# EAGLE design SubHarmonics Main Board v2 (EAGLE 9.6.2)
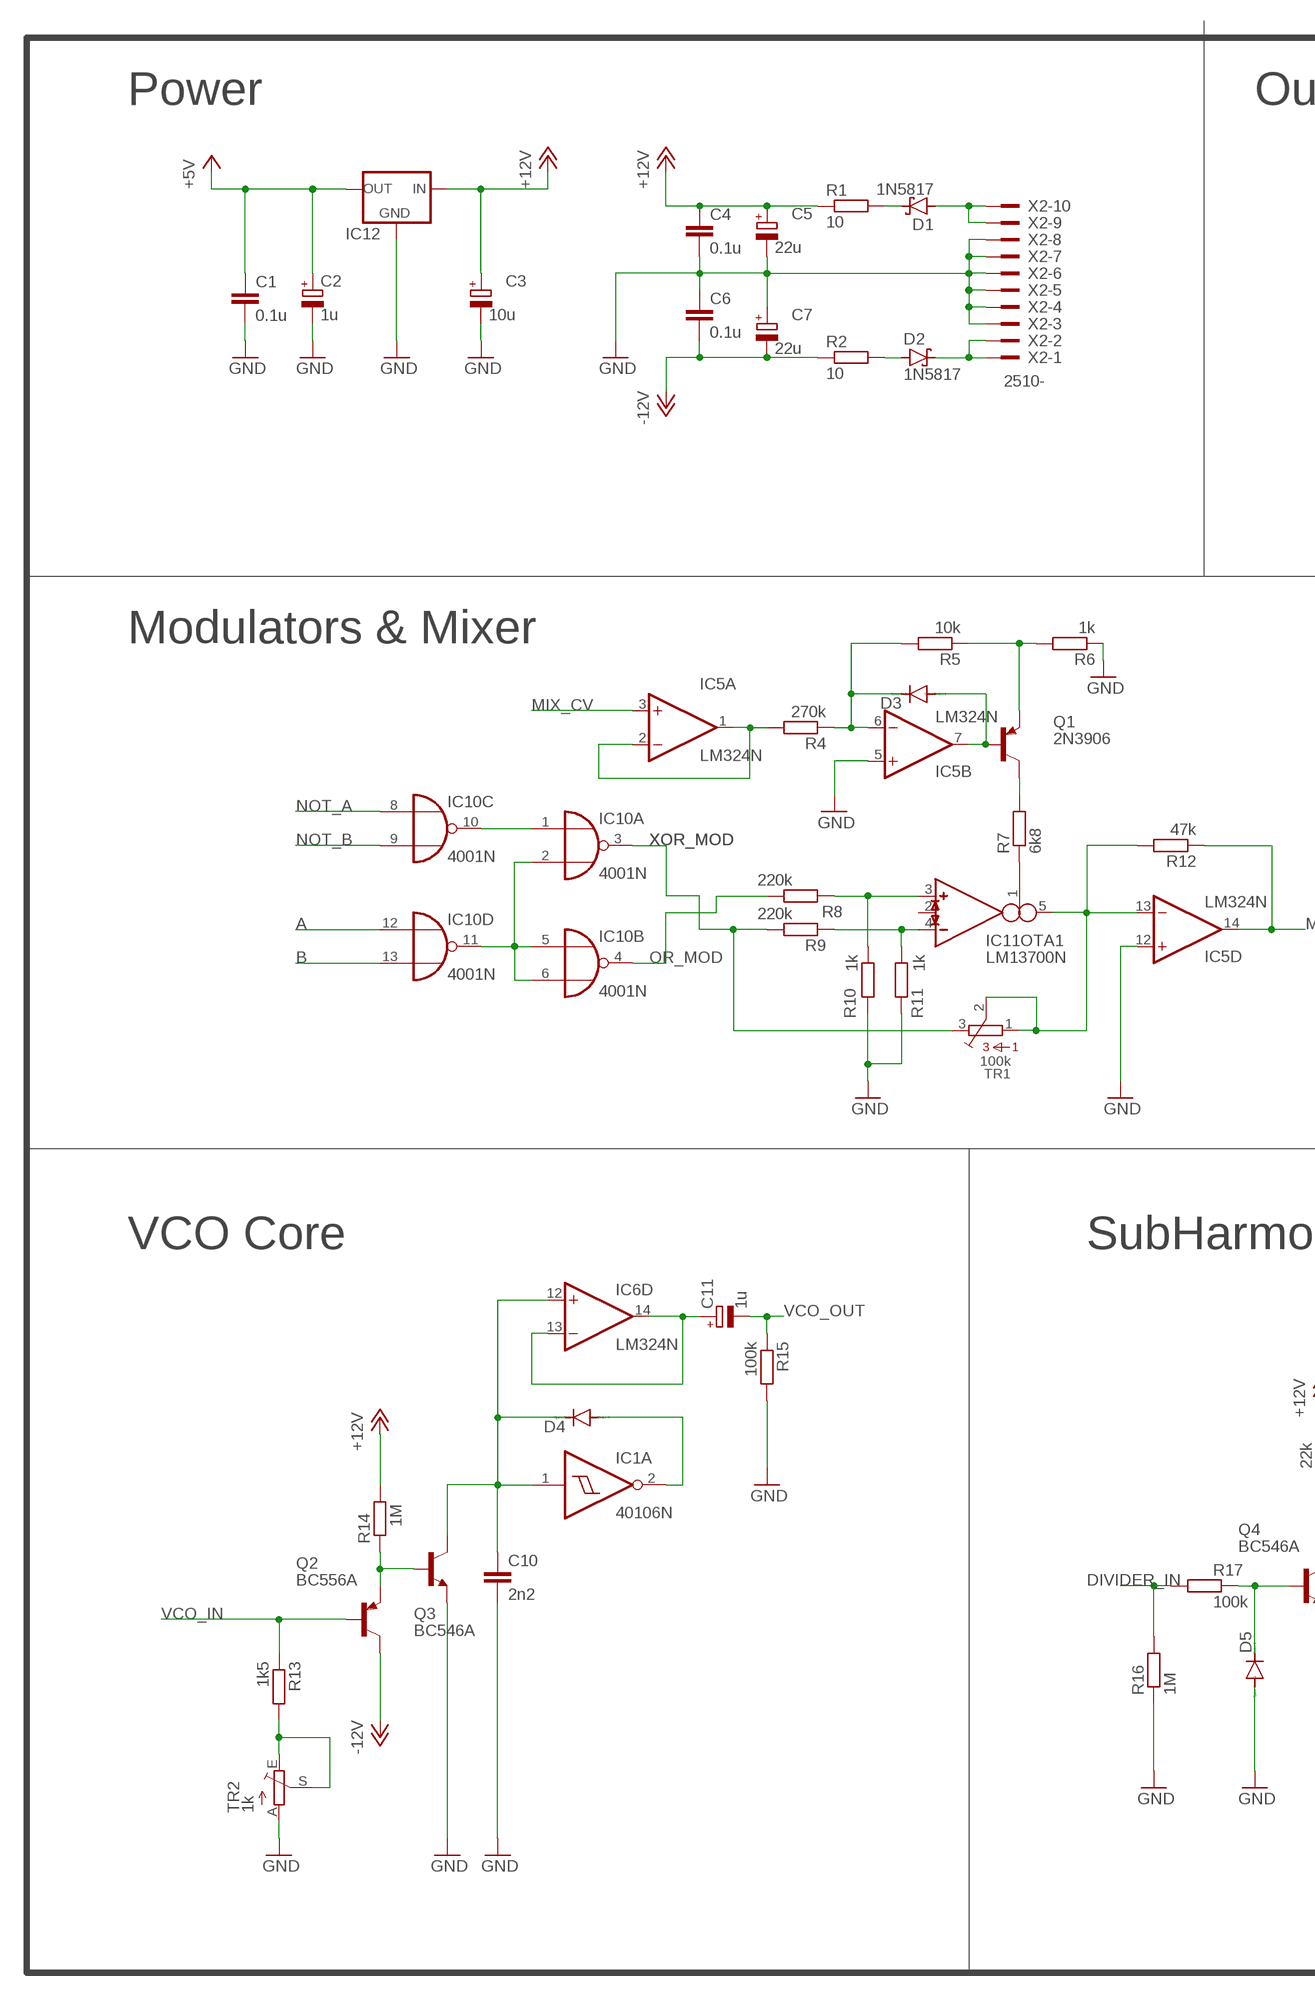
[diagram p0: schematic, sheet 1, part 1 of 2]
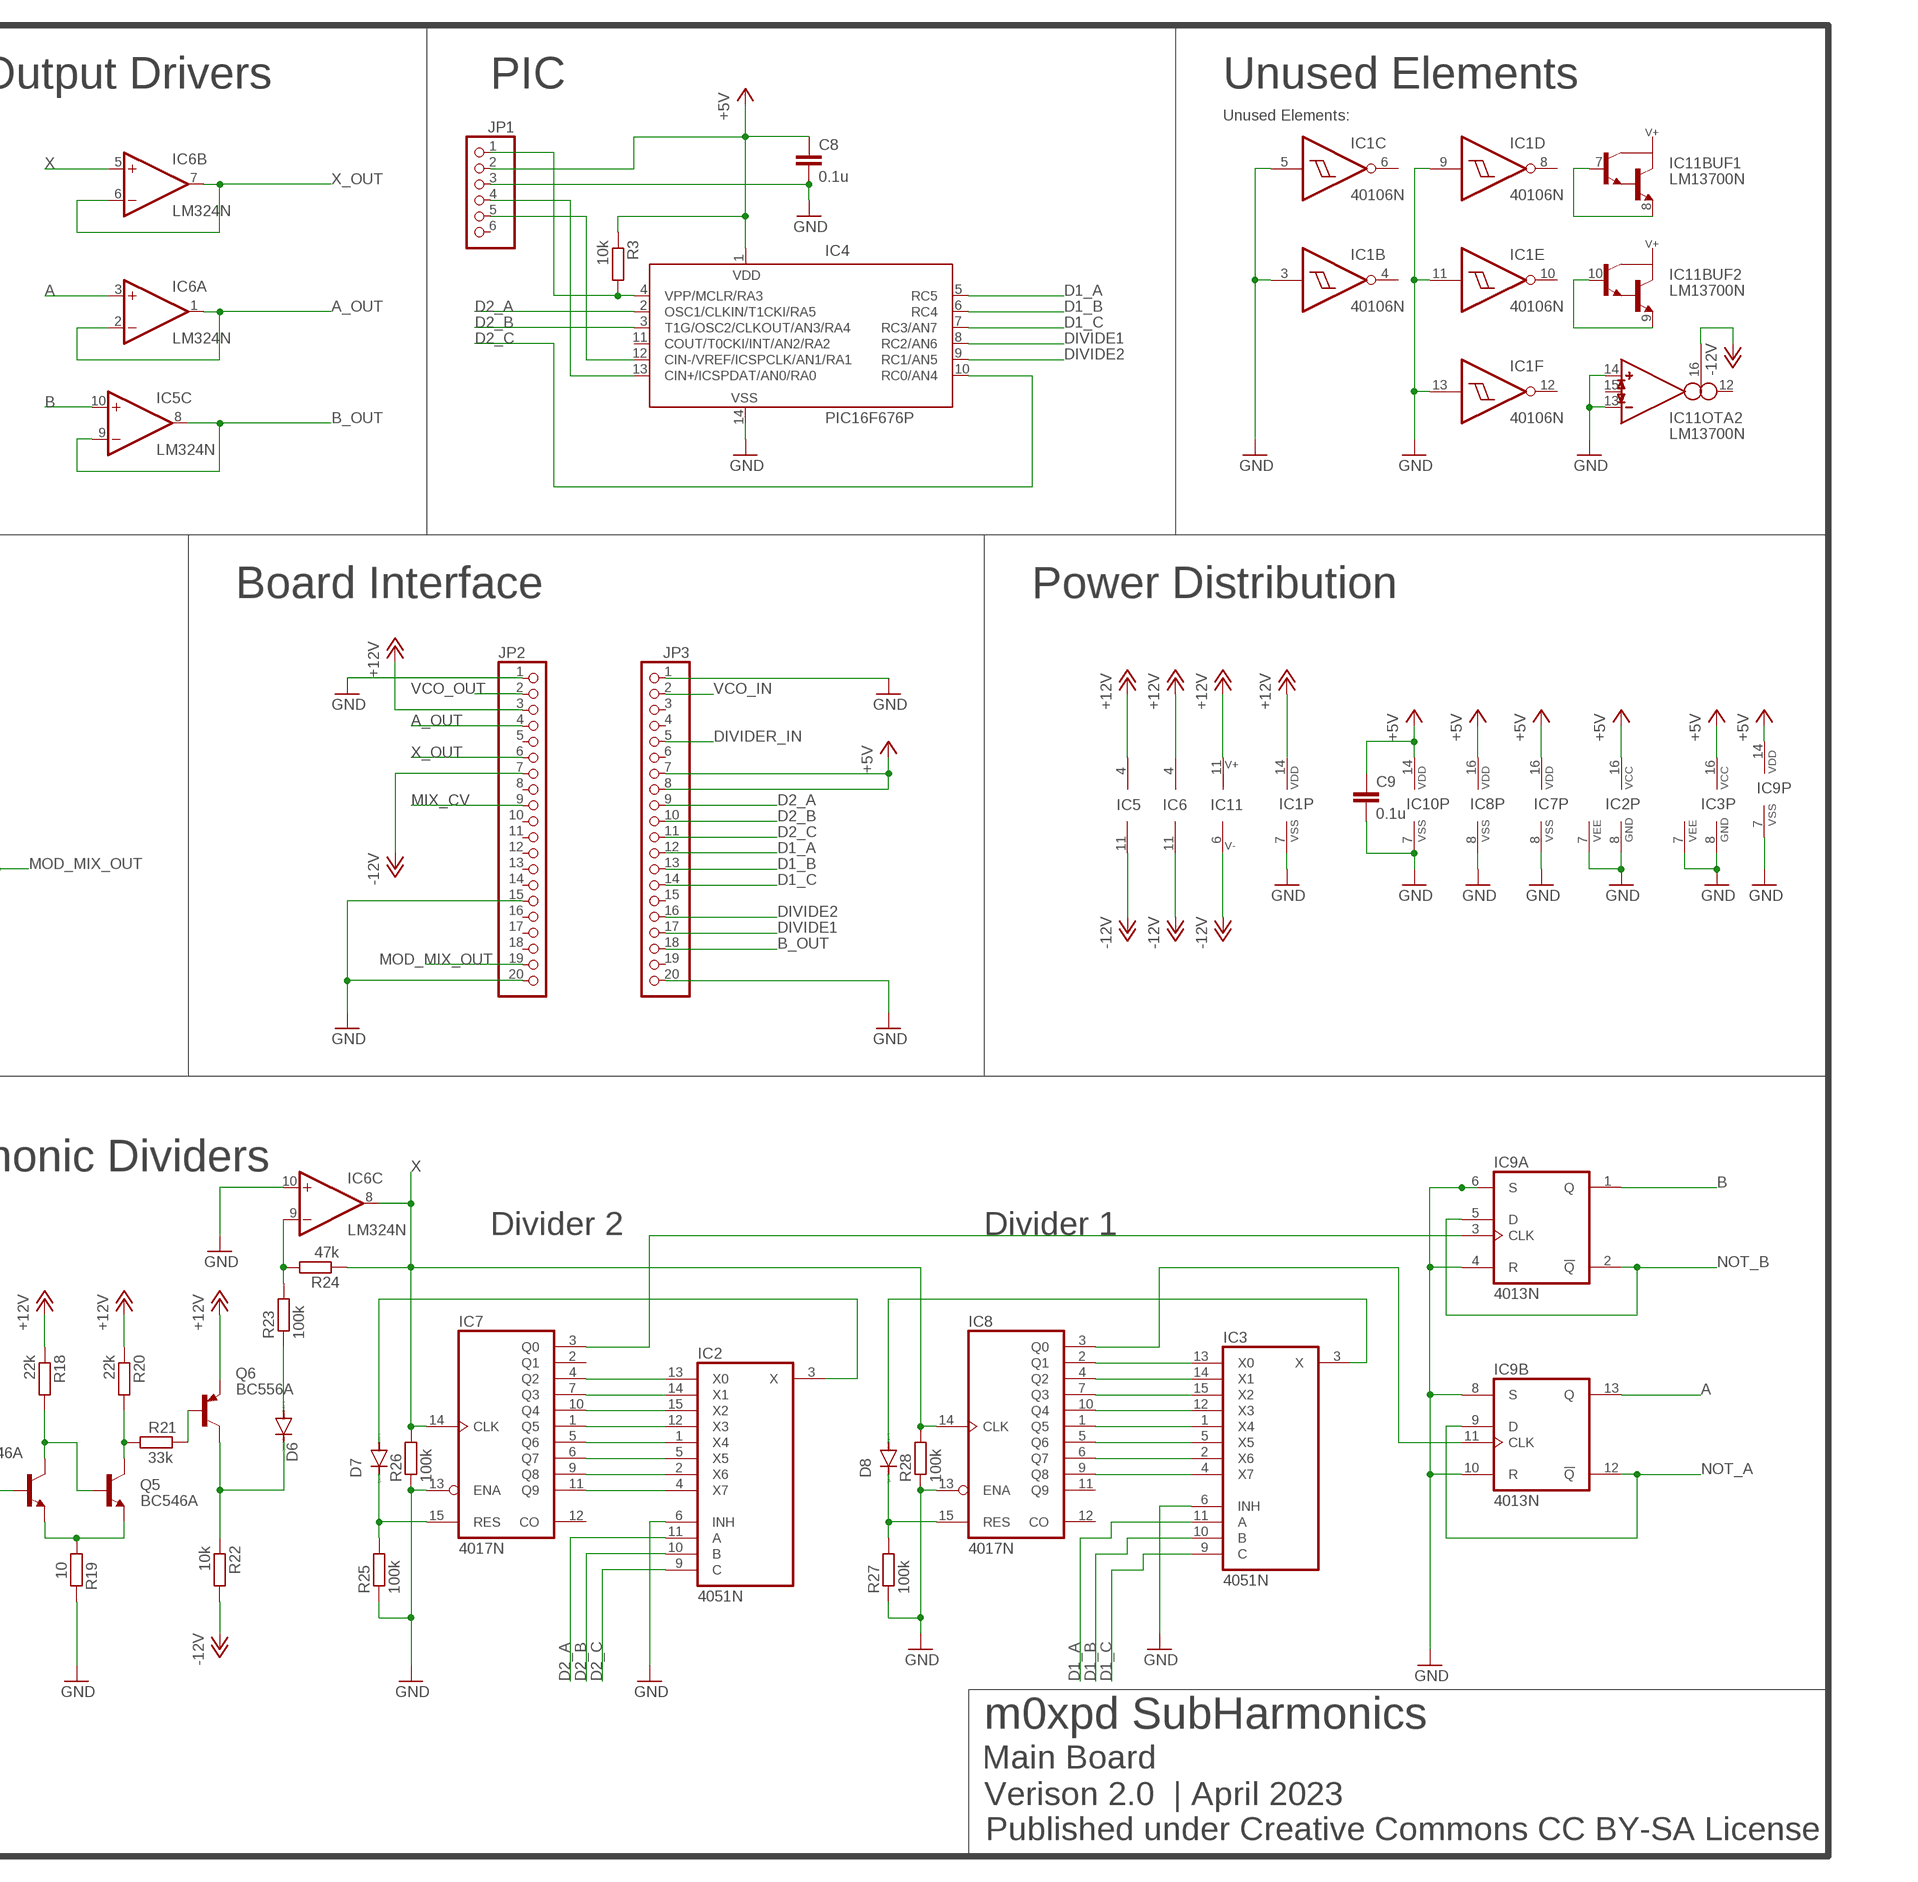
[diagram p1: schematic, sheet 1, part 2 of 2]

## Parts
C1  0.1u  C-EU050-025X075  [C050-025X075]
C2  1u  CPOL-EUE2.5-5  [E2,5-5]
C3  10u  CPOL-EUE2.5-5  [E2,5-5]
C4  0.1u  C-EU050-025X075  [C050-025X075]
C5  22u  CPOL-EUE2.5-5  [E2,5-5]
C6  0.1u  C-EU050-025X075  [C050-025X075]
C7  22u  CPOL-EUE2.5-5  [E2,5-5]
C8  0.1u  C-EU050-025X075  [C050-025X075]
C9  0.1u  C-EU050-025X075  [C050-025X075]
C10  2n2  C-EU050-030X075  [C050-030X075]
C11  1u  CPOL-EUE2.5-5  [E2,5-5]
D1  1N5817  SCHOTTKY-DIODEDO35-7  [DO35-7]
D2  1N5817  SCHOTTKY-DIODEDO35-7  [DO35-7]
D3  1N4148DO35-7  [DO35-7]
D4  1N4148DO35-7  [DO35-7]
D5  1N4148DO35-7  [DO35-7]
D6  1N4148DO35-7  [DO35-7]
D7  1N4148DO35-7  [DO35-7]
D8  1N4148DO35-7  [DO35-7]
IC1  40106N  [DIL14]
IC2  4051N  [DIL16]
IC3  4051N  [DIL16]
IC4  PIC16F676P  [DIL14]
IC5  LM324N  [DIL14]
IC6  LM324N  [DIL14]
IC7  4017N  [DIL16]
IC8  4017N  [DIL16]
IC9  4013N  [DIL14]
IC10  4001N  [DIL14]
IC11  LM13700N  [DIL16]
IC12  78LXX  [78LXX]
JP1  PINHD-1X6  [1X06]
JP2  PINHD-1X20  [1X20]
JP3  PINHD-1X20  [1X20]
Q1  2N3906  [TO92]
Q2  BC556A  [TO92-EBC]
Q3  BC546A  [TO92-EBC]
Q4  BC546A  [TO92-EBC]
Q5  BC546A  [TO92-EBC]
Q6  BC556A  BC556  [TO92-EBC]
R1  10  R-EU_0204/7  [0204/7]
R2  10  R-EU_0204/7  [0204/7]
R3  10k  R-EU_0204/7  [0204/7]
R4  270k  R-EU_0204/7  [0204/7]
R5  10k  R-EU_0204/7  [0204/7]
R6  1k  R-EU_0204/7  [0204/7]
R7  6k8  R-EU_0204/7  [0204/7]
R8  220k  R-EU_0204/7  [0204/7]
R9  220k  R-EU_0204/7  [0204/7]
R10  1k  R-EU_0204/7  [0204/7]
R11  1k  R-EU_0204/7  [0204/7]
R12  47k  R-EU_0204/7  [0204/7]
R13  1k5  R-EU_0204/7  [0204/7]
R14  1M  R-EU_0204/7  [0204/7]
R15  100k  R-EU_0204/7  [0204/7]
R16  1M  R-EU_0204/7  [0204/7]
R17  100k  R-EU_0204/7  [0204/7]
R18  22k  R-EU_0204/7  [0204/7]
R19  10  R-EU_0204/7  [0204/7]
R20  22k  R-EU_0204/7  [0204/7]
R21  33k  R-EU_0204/7  [0204/7]
R22  10k  R-EU_0204/7  [0204/7]
R23  100k  R-EU_0204/7  [0204/7]
R24  47k  R-EU_0204/7  [0204/7]
R25  100k  R-EU_0204/7  [0204/7]
R26  100k  R-EU_0204/7  [0204/7]
R27  100k  R-EU_0204/7  [0204/7]
R28  100k  R-EU_0204/7  [0204/7]
TR1  100k  BOURNS_3362P_TRIMMERP  [BOURNS_3362P_TRIMMER]
TR2  1k  TRIM_EU-B64Y  [B64Y]
X2  2510-  [PAK100/2500-10]

## Nets
+5V: C1.1 C2.+ C8.1 C9.1 IC2.16(VCC) IC3.16(VCC) IC4.1(VDD) IC7.16(VDD) IC8.16(VDD) IC9.14(P:VDD) IC10.14(P:VDD) IC12.OUT JP1.2 JP3.7 JP3.8 R3.1
+12V: C3.+ C4.1 C5.+ IC1.14(P:VDD) IC5.4(P:V+) IC6.4(P:V+) IC11.11(SUPPLY:V+) IC12.IN JP2.3 Q6.E R1.1 R14.2 R18.1 R20.1
-12V: C6.2 C7.- IC5.11(P:V-) IC6.11(P:V-) IC11.6(SUPPLY:V-) IC11.16(OTA2:I_BIAS) JP2.7 Q2.C R2.1 R22.2
A: IC6.3(A:+IN) IC9.13(B:Q) IC10.12(D:I0)
A_OUT: IC6.1(A:OUT) IC6.2(A:-IN) JP2.4
B: IC5.10(C:+IN) IC9.1(A:Q) IC10.13(D:I1)
B_OUT: IC5.8(C:OUT) IC5.9(C:-IN) JP3.18
D1_A: IC3.11(A) IC4.5(RC5) JP3.12
D1_B: IC3.10(B) IC4.6(RC4) JP3.13
D1_C: IC3.9(C) IC4.7(RC3/AN7) JP3.14
D2_A: IC2.11(A) IC4.2(OSC1/CLKIN/T1CKI/RA5) JP3.9
D2_B: IC2.10(B) IC4.3(T1G/OSC2/CLKOUT/AN3/RA4) JP3.10
D2_C: IC2.9(C) IC4.10(RC0/AN4) JP3.11
DIVIDE1: IC4.8(RC2/AN6) JP3.17
DIVIDE2: IC4.9(RC1/AN5) JP3.16
DIVIDER_IN: JP3.5 R16.2 R17.1
GND: C1.2 C2.- C3.- C4.2 C5.- C6.1 C7.+ C8.2 C9.2 C10.2 D5.A IC1.3(B:I) IC1.5(C:I) IC1.7(P:VSS) IC1.9(D:I) IC1.11(E:I) IC1.13(F:I) IC2.6(INH) IC2.7(VEE) IC2.8(GND) IC3.6(INH) IC3.7(VEE) IC3.8(GND) IC4.14(VSS) IC5.5(B:+IN) IC5.12(D:+IN) IC6.10(C:+IN) IC7.8(VSS) IC7.13(ENA) IC8.8(VSS) IC8.13(ENA) IC9.4(A:R) IC9.6(A:S) IC9.7(P:VSS) IC9.8(B:S) IC9.10(B:R) IC10.7(P:VSS) IC11.13(OTA2:IN_N) IC11.14(OTA2:IN_P) IC12.GND JP1.3 JP2.1 JP2.15 JP2.20 JP3.1 JP3.20 Q3.E R6.1 R10.2 R11.2 R15.2 R16.1 R19.2 R25.1 R26.1 R27.1 R28.1 TR2.A X2.3 X2.4 X2.5 X2.6 X2.7 X2.8
MIX_CV: IC5.3(A:+IN) JP2.9
MOD_MIX_OUT: IC5.14(D:OUT) JP2.19 R12.1
N$1: IC2.2(X6) IC7.9(Q8)
N$2: IC5.1(A:OUT) IC5.2(A:-IN) R4.2
N$3: D7.C IC7.15(RES) R25.2
N$4: D7.A IC2.3(X)
N$5: IC2.13(X0) IC7.4(Q2)
N$6: IC2.14(X1) IC7.7(Q3)
N$7: IC2.15(X2) IC7.10(Q4)
N$8: IC2.12(X3) IC7.1(Q5)
N$9: IC2.1(X4) IC7.5(Q6)
N$10: IC2.5(X5) IC7.6(Q7)
N$11: IC2.4(X7) IC7.11(Q9)
N$12: IC11.3(OTA1:IN_P) R8.1 R10.1
N$13: D1.A X2.9 X2.10
N$14: D1.C R1.2
N$15: IC4.4(VPP/MCLR/RA3) JP1.1 R3.2
N$16: D8.C IC8.15(RES) R27.2
N$17: D8.A IC3.3(X)
N$18: IC11.7(BUF1:B) IC11.8(BUF1:E)
N$19: IC3.14(X1) IC8.4(Q2)
N$20: IC3.15(X2) IC8.7(Q3)
N$21: IC3.12(X3) IC8.10(Q4)
N$22: IC3.1(X4) IC8.1(Q5)
N$23: IC3.5(X5) IC8.5(Q6)
N$24: IC3.2(X6) IC8.6(Q7)
N$25: IC3.4(X7) IC8.9(Q8)
N$26: IC11.4(OTA1:IN_N) R9.1 R11.1
N$27: D2.A R2.2
N$28: D2.C X2.1 X2.2
N$29: IC11.9(BUF2:E) IC11.10(BUF2:B)
N$30: IC11.1(OTA1:I_BIAS) R7.1
N$31: IC4.13(CIN+/ICSPDAT/AN0/RA0) JP1.4
N$32: IC4.12(CIN-/VREF/ICSPCLK/AN1/RA1) JP1.5
N$33: IC3.13(X0) IC8.2(Q1)
N$34: IC8.3(Q0) IC9.11(B:CLK)
N$35: IC7.3(Q0) IC9.3(A:CLK)
N$37: R13.2 TR2.E TR2.S
N$47: D6.C Q6.C R22.1
N$48: D6.A R23.1
N$49: D4.A IC1.2(A:O)
N$50: C10.1 D4.C IC1.1(A:I) IC6.12(D:+IN) Q3.C
N$51: Q2.E Q3.B R14.1
N$52: IC6.9(C:-IN) R23.2 R24.2
N$53: C11.+ IC6.13(D:-IN) IC6.14(D:OUT)
N$55: Q4.E Q5.E R19.1
N$68: IC10.1(A:I0) IC10.10(C:O)
N$69: IC10.2(A:I1) IC10.5(B:I0) IC10.6(B:I1) IC10.11(D:O)
N$70: D5.C Q4.B R17.2
N$80: Q1.1(C) R7.2
N$84: D3.C IC5.6(B:-IN) R4.1 R5.2
N$85: Q4.C Q5.B R18.2
N$86: Q5.C R20.2 R21.1
N$87: D3.A IC5.7(B:OUT) Q1.2(B)
N$88: Q1.3(E) R5.1 R6.2
N$89: Q6.B R21.2
N$91: IC5.13(D:-IN) IC11.5(OTA1:OUT) R12.2 TR1.1 TR1.2
NOT_A: IC9.9(B:D) IC9.12(B:!Q) IC10.8(C:I0)
NOT_B: IC9.2(A:!Q) IC9.5(A:D) IC10.9(C:I1)
OR_MOD: IC10.4(B:O) R8.2
VCO_IN: JP3.2 Q2.B R13.1
VCO_OUT: C11.- JP2.2 R15.1
X: IC6.5(B:+IN) IC6.8(C:OUT) IC7.14(CLK) IC8.14(CLK) R24.1 R26.2 R28.2
X_OUT: IC6.6(B:-IN) IC6.7(B:OUT) JP2.6
XOR_MOD: IC10.3(A:O) R9.2 TR1.3
Unconnected: IC1.4(B:O) IC1.6(C:O) IC1.8(D:O) IC1.10(E:O) IC1.12(F:O) IC4.11(COUT/T0CKI/INT/AN2/RA2) IC7.2(Q1) IC7.12(CO) IC8.11(Q9) IC8.12(CO) IC11.2(OTA1:I_DIODE) IC11.12(OTA2:OUT) IC11.15(OTA2:I_DIODE) JP1.6 JP2.5 JP2.8 JP2.10 JP2.11 JP2.12 JP2.13 JP2.14 JP2.16 JP2.17 JP2.18 JP3.3 JP3.4 JP3.6 JP3.15 JP3.19

## Notes on the sheet
- Power | Output Drivers | PIC | Unused Elements
- Unused Elements:
- Modulators & Mixer | Board Interface | Power Distribution
- IC5 | IC6 | IC11
- VCO Core | SubHarmonic Dividers
- Divider 2 | Divider 1
- m0xpd SubHarmonics
- Main Board
- Verison 2.0  | April 2023
- Published under Creative Commons CC BY-SA License

## Library data of the parts
C1 C4 C6 C8-C10 = rcl:C-EU: CAPACITOR, European symbol; SPICEPREFIX: C
C2 C3 C5 C7 C11 = rcl:CPOL-EU: POLARIZED CAPACITOR, European symbol; SPICEPREFIX: C
D1 D2 = diode:SCHOTTKY-DIODE: Schottky Diode
D3-D8 = diode:1N4148: DIODE high speed (Philips)
IC1 = 40xx:40106: Hex SCHMITT TRIGGER
IC2 IC3 = 40xx:4051: 8-channel ANALOG MULTIPLEXER
IC4 = microchip:PIC16F676: 14-Pin, Flash-Based 8-Bit CMOS Microcontroller High Performance RISC CPU: * Only 35 instructions to learn - All single-cycle instructions except branches * Operating speed: - DC - 20 MHz oscillator/clock input - DC - 200 ns instruction cycle * Internal and external oscillator options - Precision Internal 4 MHz oscillator factory calibrated to ±1% - External Oscillator support for crystals and resonators - 5?s wake-up from SLEEP, 3.0V, typical * Power saving SLEEP mode * Wide operating voltage range - 2.0V to 5.5V * Industrial and Extended temperature range * Low power Power-on Reset (POR) * Power-up Timer (PWRT) and Oscillator Start-up Timer (OST) * Brown-out Detect (BOD) * Watchdog Timer (WDT) with independent oscillator for reliable operation * Multiplexed MCLR/Input-pin * Interrupt-on-pin change * Individual programmable weak pull-ups * Programmable code protection * High Endurance FLASH/EEPROM Cell - 100,000 write FLASH endurance - 1,000,000 write EEPROM endurance - FLASH/Data EEPROM Retention: > 40 years * Standby Current: - 1 nA @ 2.0V, typical * Operating Current: - 8.5?A @ 32 kHz, 2.0V, typical - 100?A @ 1 MHz, 2.0V, typical * Watchdog Timer Current - 300 nA @ 2.0V, typical * Timer1 oscillator current: - 4?A @ 32 kHz, 2.0V, typical * 12 I/O pins with individual direction control * High current sink/source for direct LED drive * Analog-to-Digital Converter module (PIC16F676): - 10-bit resolution - Programmable 8-channel input - Voltage reference input * In-Circuit Serial ProgrammingTM (ICSPTM) via two pins Source: http://ww1.microchip.com/downloads/en/DeviceDoc/40039E.pdf; MF: MICROCHIP; MPN: PIC16F676-I/P; OC_FARNELL: 9760512; OC_NEWARK: 54K2829
IC5 IC6 = linear:LM324: OP AMP
IC7 IC8 = 40xx:4017: COUNTER/DIVIDER
IC9 = 40xx:4013: Dual D FLIP FLOP, set/reset
IC10 = 40xx:4001: Quad 2-input NOR
IC11 = ota:LM13700: Dual OTA with buffers
IC12 = v-reg:78LXX: VOLTAGE REGULATOR
JP1 = pinhead:PINHD-1X6: PIN HEADER
JP2 JP3 = pinhead:PINHD-1X20: PIN HEADER
Q1 = transistor-pnp:2N3906: PNP Transistor
Q2 Q6 = transistor-pnp:BC556*: PNP Transistror
Q3-Q5 = transistor-npn:BC546*: NPN Transistor
R1-R28 = rcl:R-EU_: RESISTOR, European symbol; SPICEPREFIX: R
TR1 = MusicThingModular:BOURNS_3362P_TRIMMER: 3362 Series 1/4" Square Trimmer
TR2 = pot:TRIM_EU-: POTENTIOMETER
X2 = con-3m:2510-: 3M (TM) Pak 100 4-Wall Header Source: 3M; MF: 3M; MPN: 2510-6002UB; OC_FARNELL: 9838244; OC_NEWARK: 46F4725

## Board
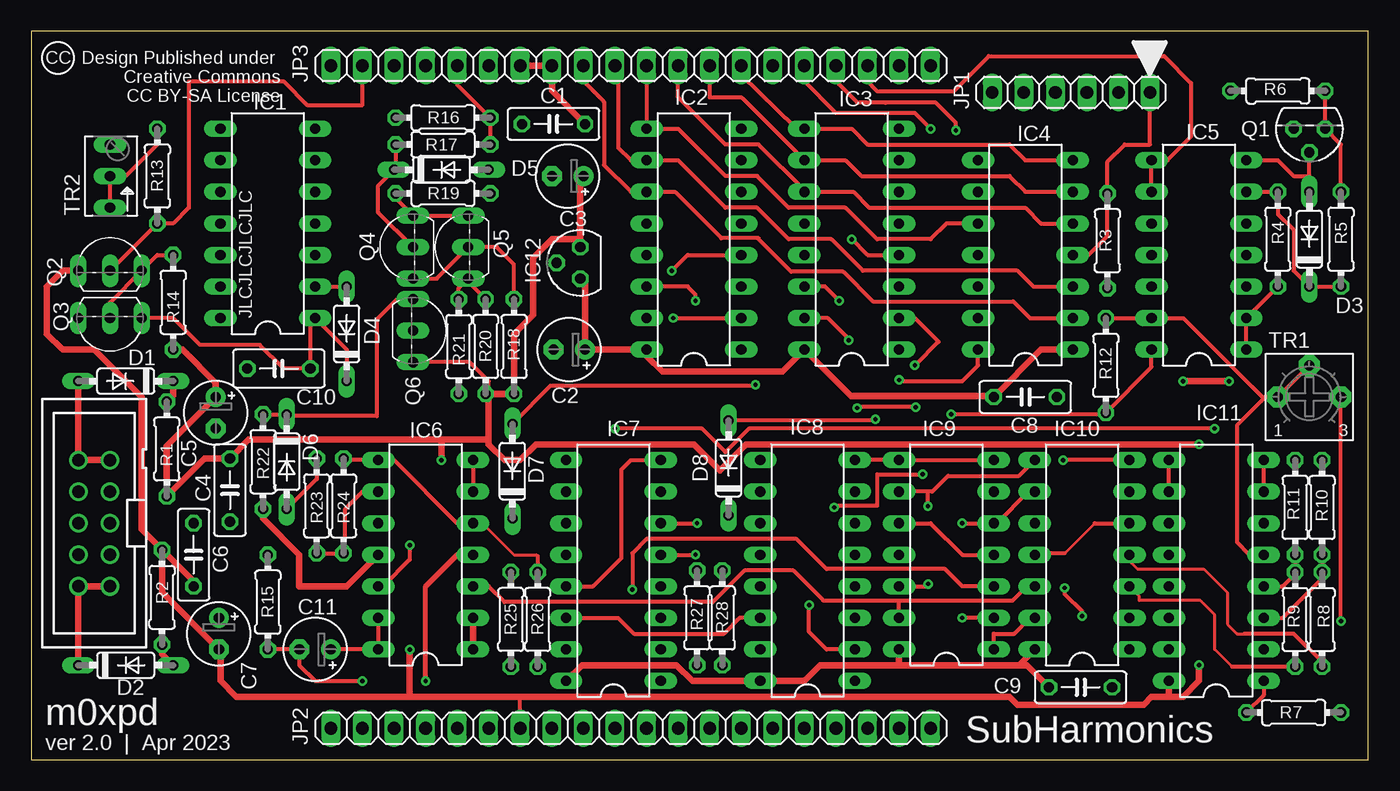
[diagram p2: board, top side]
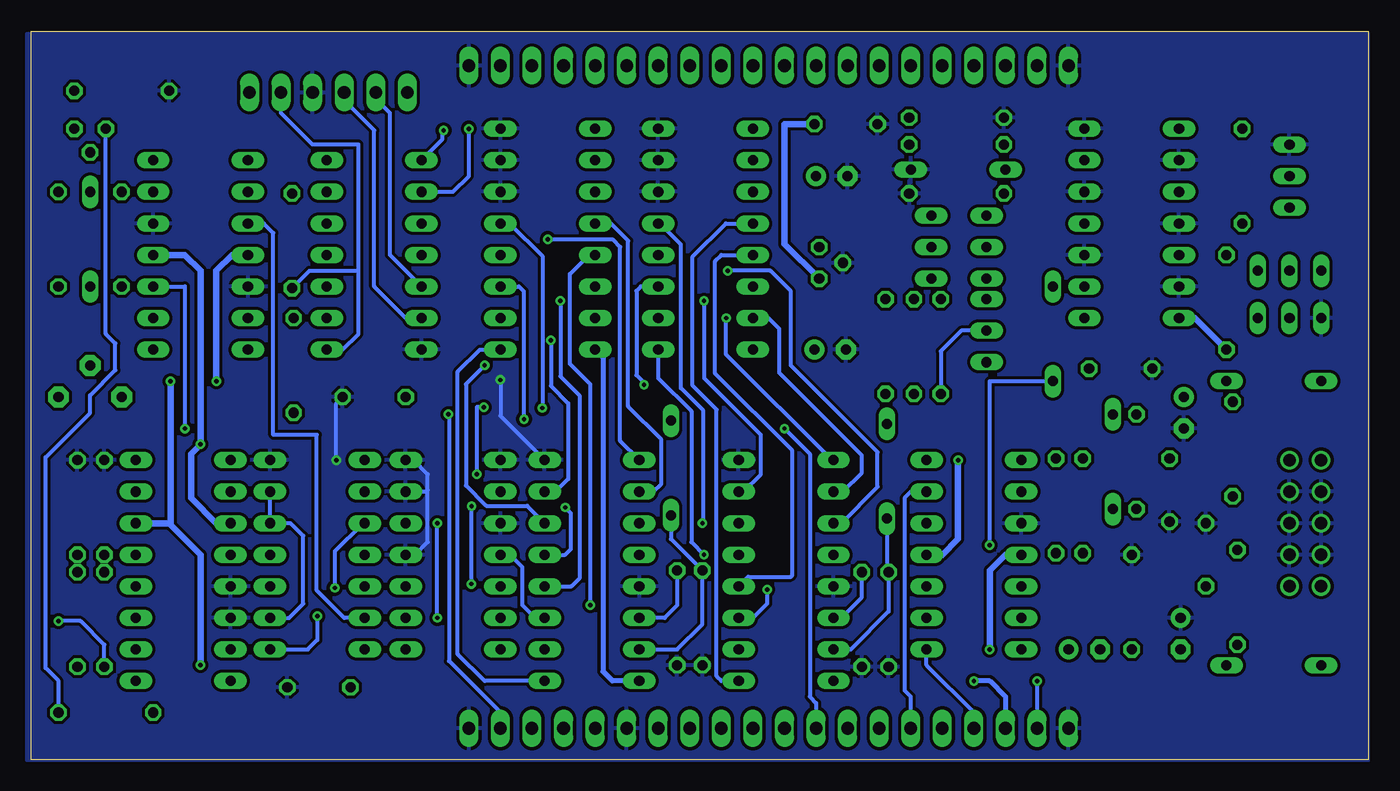
[diagram p3: board, bottom side, seen from below]

Size 107.62 x 58.66 mm. Coordinates in mm from the lower left corner, seen from the top.
Outline: 0,0 107.62,0 107.62,58.66 0,58.66 0,0
Copper layers (1*16): Top 0.035mm / dielectric 1.5mm / Bottom 0.035mm
Design rules "default *": minimum track width 6mil, minimum drill 0.35mm, track to track 10mil, track to pad 10mil, pad to pad 6mil, via to via 6mil, smd to smd 6mil, copper to edge 0mil, drill to drill 6mil, minimum pad ring 10mil, minimum via ring 8mil, stop-mask expansion 4mil, vias tented up to drill 0mil, thermal gap 10mil

### Footprints (pad centres in the part's own frame; a part is rotated, then mirrored left to right if it is on the bottom)
C050-025X075 = drill 0.813 octagon: 1 -2.54,0; 2 2.54,0
E2,5-5 = drill 0.813 pad 1.6: + -1.27,0 | drill 0.813 pad 1.6 octagon: - 1.27,0
C050-030X075 = drill 0.813 octagon: 1 -2.54,0; 2 2.54,0
DO35-7 = drill 0.813 long: A 3.81,0; C -3.81,0
DIL14 = drill 0.813 long: 1 -7.62,-3.81; 2 -5.08,-3.81; 3 -2.54,-3.81; 4 0,-3.81; 5 2.54,-3.81; 6 5.08,-3.81; 7 7.62,-3.81; 8 7.62,3.81; 9 5.08,3.81; 10 2.54,3.81; 11 0,3.81; 12 -2.54,3.81; 13 -5.08,3.81; 14 -7.62,3.81
DIL16 = drill 0.813 long: 1 -8.89,-3.81; 2 -6.35,-3.81; 3 -3.81,-3.81; 4 -1.27,-3.81; 5 1.27,-3.81; 6 3.81,-3.81; 7 6.35,-3.81; 8 8.89,-3.81; 9 8.89,3.81; 10 6.35,3.81; 11 3.81,3.81; 12 1.27,3.81; 13 -1.27,3.81; 14 -3.81,3.81; 15 -6.35,3.81; 16 -8.89,3.81
78LXX = drill 0.813 octagon: GND 0,1.905; IN 1.27,0; OUT -1.27,0
1X06 = drill 1.016 long: 1 -6.35,0; 2 -3.81,0; 3 -1.27,0; 4 1.27,0; 5 3.81,0; 6 6.35,0
1X20 = drill 1.016 long: 1 -24.13,0; 2 -21.59,0; 3 -19.05,0; 4 -16.51,0; 5 -13.97,0; 6 -11.43,0; 7 -8.89,0; 8 -6.35,0; 9 -3.81,0; 10 -1.27,0; 11 1.27,0; 12 3.81,0; 13 6.35,0; 14 8.89,0; 15 11.43,0; 16 13.97,0; 17 16.51,0; 18 19.05,0; 19 21.59,0; 20 24.13,0
TO92 = drill 0.813 octagon: 1 1.27,0; 2 0,1.905; 3 -1.27,0
TO92-EBC = drill 0.813 long: B 0,-1.27; C -2.54,-1.27; E 2.54,-1.27
0204/7 = drill 0.813 octagon: 1 -3.81,0; 2 3.81,0
BOURNS_3362P_TRIMMER = drill 0.813 pad 1.676 octagon: 1 -2.54,0; 2 0,2.54; 3 2.54,0
B64Y = drill 0.813 long: A 2.54,0; E -2.54,0; S 0,0
PAK100/2500-10 = drill 1 pad 1.422: 1 -5.08,-1.27; 2 -5.08,1.27; 3 -2.54,-1.27; 4 -2.54,1.27; 5 0,-1.27; 6 0,1.27; 7 2.54,-1.27; 8 2.54,1.27; 9 5.08,-1.27; 10 5.08,1.27

### Placement (x,y rotation side)
C1  42.04,51.18 180 top
C2  43.31,33.02 180 top
C3  43.18,46.99 180 top
C4  16,21.72 270 top
C5  14.86,27.94 270 top
C6  13.08,16.51 270 top
C7  15.11,10.16 270 top
C8  80.01,29.21 0 top
C9  84.45,5.84 0 top
C10  19.94,31.5 180 top
C11  22.86,8.89 180 top
D1  7.62,30.48 180 top
D2  7.62,7.62 0 top
D3  102.87,41.91 90 top
D4  25.4,34.29 90 top
D5  33.02,47.5 0 top
D6  20.57,24 270 top
D7  38.73,23.24 90 top
D8  56.13,23.5 90 top
IC1  19.05,43.18 90 top
IC2  53.34,41.91 90 top
IC3  66.04,41.91 90 top
IC4  80.01,40.64 90 top
IC5  93.98,40.64 90 top
IC6  31.75,16.51 90 top
IC7  46.86,15.24 90 top
IC8  62.48,15.24 90 top
IC9  73.66,16.51 90 top
IC10  84.58,16.51 90 top
IC11  95.38,15.24 90 top
IC12  44.2,40.01 90 top
JP1  83.69,53.72 180 top
JP2  48.26,2.54 0 top
JP3  48.26,55.88 0 top
Q1  102.87,50.8 180 top
Q2  6.35,40.64 0 top
Q3  6.35,34.29 180 top
Q4  29.46,41.27 90 top
Q5  33.91,41.27 90 top
Q6  32,34.54 270 top
R1  10.92,25.02 90 top
R2  10.54,13.08 270 top
R3  86.61,41.78 90 top
R4  100.33,41.91 270 top
R5  105.41,41.91 270 top
R6  100.33,53.85 0 top
R7  101.6,3.81 0 top
R8  103.89,11.3 270 top
R9  101.73,11.3 270 top
R10  103.89,20.32 90 top
R11  101.73,20.32 90 top
R12  86.49,31.75 90 top
R13  10.16,46.99 90 top
R14  11.43,36.83 270 top
R15  19.05,12.7 90 top
R16  33.15,51.69 0 top
R17  33.15,49.53 180 top
R18  38.86,33.27 90 top
R19  See Text  [0204/7]  33.15,45.59 0 top
R20  36.58,33.27 90 top
R21  34.42,33.27 270 top
R22  18.67,24 270 top
R23  22.99,20.45 270 top
R24  25.15,20.45 270 top
R25  38.61,11.3 90 top
R26  40.77,11.3 90 top
R27  53.59,11.43 90 top
R28  55.63,11.43 90 top
TR1  102.87,29.21 0 top
TR2  6.35,46.99 90 top
X2  5.08,19.05 90 top

### Tracks (layer width: path | path; a pad name or v marks a point on that pad's centre or on a via)
+5V
  Top 0.508: IC4.1 81.28,33.02 C8.1 77.39,29.29 65.96,29.29 IC3.16 60.45,31.24 50.8,31.24 49.53,32.51 IC2.16 C2.+ 44.58,38.35 IC12.OUT | IC7.16 44.32,7.62 51.94,7.62 53.21,6.35 IC8.16 62.23,6.35 63.5,7.62 69.85,7.62 | 79.5,7.62 69.85,7.62 | IC10.14 79.5,7.62 | C1.1 41.91,53.85 JP3.8 JP3.7 | IC9.14 69.85,7.62 | 79.5,7.62 80.14,7.62 C9.1
  Bottom 0.305: IC3.16 61.59,32.38 | IC4.1 82.55,33.02 81.28,34.29 81.28,39.37 | 81.28,39.37 81.28,49.53 84.96,49.53 87.5,52.07 JP1.2 | R3.1 85.22,39.37 81.28,39.37
  Bottom 0.406: 61.59,32.38 61.59,7.11 60.83,6.35 IC8.16
  Bottom 0.508: IC12.OUT 46.99,41.53 46.99,51.18 C1.1
+12V  (via drill 0.35)
  Top 0.305: 36.83,29.72 36.83,30.48 35.31,32 Q6.E
  Top 0.406: v31.75,6.35 31.75,13.97 34.29,16.51 IC6.4
  Top 0.508: IC12.IN 44.2,41.91 | C3.+ 44.2,46.74 44.2,41.91 | 33.02,25.78 17.53,25.78 C4.1 13.97,24.26 R1.1 10.92,25.27 C5.+ 14.86,30.35 12.19,33.02 R14.2 | 33.02,25.78 36.83,25.78 | v93.98,25.4 57.53,25.4 55.44,23.3 53.34,25.4 40.64,25.4 39.37,24.13 38.1,24.13 36.83,25.4 36.83,25.78 | v33.02,24.13 33.02,25.78 | R20.1 R18.1 38.86,34.29 40.39,35.81 40.39,40.39 41.91,41.91 44.2,41.91 | R20.1 36.83,29.21 36.83,25.78 | R20.1 36.83,29.72
  Bottom 0.406: v31.75,6.35 30.48,6.35 29.21,5.08 JP2.3
  Bottom 0.508: R14.2 13.97,35.56 IC1.14 | IC5.4 95.25,40.64 93.98,39.37 v93.98,25.4 94.74,24.64 94.74,21.08 92.71,19.05 IC11.11 | IC6.4 34.29,16.51 33.02,17.78 v33.02,24.13
-12V  (via drill 0.35)
  Top 0.305: JP2.7 39.37,5.08
  Top 0.508: R2.1 10.54,13.46 C7.- 15.24,8.76 15.24,6.35 16.51,5.08 30.48,5.08 | R22.2 18.67,19.43 21.59,16.51 21.59,13.97 25.4,13.97 IC6.11 | R2.1 13.08,14.35 C6.2 | 30.48,5.08 39.37,5.08 78.74,5.08 79.38,4.45 89.53,4.45 90.17,5.08 91.57,5.08 | 91.57,5.08 92.71,5.08 93.98,6.35 v93.98,7.62 | v92.71,30.48 v96.39,30.48 | R2.1 8.89,18.54 8.89,29.21 5.08,33.02 2.54,33.02 1.27,34.29 1.27,38.1 2.54,39.37 Q2.C | v30.48,8.89 30.48,5.08 | IC11.16 91.57,5.08
  Bottom 0.508: v93.98,7.62 93.98,16.51 96.39,18.92 | IC11.6 96.52,19.05 96.39,18.92 | IC5.11 91.44,40.64 92.71,39.37 v92.71,30.48 | v96.39,30.48 96.39,18.92 | IC6.11 29.21,16.51 30.48,15.24 v30.48,8.89
A
  Top 0.305: IC10.12 80.14,13.97 78.99,12.83 69.85,12.83 | IC6.3 36.83,13.97 38.1,12.7 54.86,12.7 57.4,15.24 61.34,15.24 63.75,12.83 69.85,12.83 | IC9.13 69.85,12.83
A_OUT
  Top 0.508: IC6.2 IC6.1
  Bottom 0.305: JP2.4 31.75,3.81 35.56,7.62 IC6.1
B
  Top 0.305: IC10.13 80.39,11.43 79.12,10.16 77.47,10.16 IC9.1
  Bottom 0.305: IC10.13 82.42,11.43 84.63,13.64 84.63,26.16 88.14,26.16 88.14,42.42 88.9,43.18 IC5.10
B_OUT
  Top 0.305: IC5.9 IC5.8 91.44,48.26 93.34,50.16 93.34,54.48 91.19,56.64 77.06,56.64 74.22,53.8 68.12,53.8 67.31,54.61 JP3.18
D1_A
  Top 0.305: IC4.5 81.28,43.18 80.01,44.45 67.44,44.45 66.17,45.72 IC3.11 62.23,45.85 58.55,49.53 55.88,49.53 52.07,53.34 JP3.12
D1_B
  Top 0.305: IC4.6 80.01,45.72 78.74,46.99 66.8,46.99 65.53,48.26 IC3.10 57.15,53.34 54.61,53.34 JP3.13
D1_C
  Top 0.305: IC4.7 80.01,48.26 78.74,49.53 67.31,49.53 66.04,50.8 IC3.9 62.1,50.93 61.46,50.93 57.15,55.1 JP3.14
D2_A
  Top 0.305: IC4.2 80.38,35.56 79.04,36.91 67.74,36.91 65.35,39.29 61.16,39.29 58.55,41.91 58.55,41.99 55.55,41.99 51.82,45.72 IC2.11 48.26,45.72 46.1,47.88 46.1,52.96 44.45,54.61 JP3.9
D2_B
  Top 0.305: IC4.3 80.64,38.1 79.38,39.37 66.93,39.37 64.39,41.91 60.96,41.91 58.42,44.45 55.88,44.45 52.07,48.26 IC2.10 48.26,48.26 47.24,49.28 47.24,55.63 JP3.10
D2_C
  Top 0.305: IC4.10 73.66,43.18 72.39,41.91 68.07,41.91 65.53,44.45 60.96,44.45 58.42,46.99 55.88,46.99 52.07,50.8 IC2.9 JP3.11
DIVIDE1  (via drill 0.35)
  Top 0.305: v74.42,50.67 74.42,51.31 72.83,52.9 68.77,52.9 66.48,52.9 64.77,54.61 JP3.17
  Bottom 0.305: IC4.8 74.55,49.91 74.55,50.55 v74.42,50.67
DIVIDE2  (via drill 0.35)
  Top 0.305: v72.39,50.8 71.12,52.07 67.31,52.07 66.93,52.07 64.77,52.07 62.23,54.61 JP3.16
  Bottom 0.305: IC4.9 73.66,45.72 72.39,46.99 v72.39,50.8
DIVIDER_IN
  Top 0.305: R17.1 R16.2 34.29,54.36 JP3.5
GND  (via drill 0.35)
  Top 0.152: v69.85,30.58 69.95,30.48
  Top 0.305: IC7.13 45.21,13.97 47.5,16.26 47.5,23.37 48.26,24.13 IC7.8 | 69.95,30.48 74.93,30.48 76.2,31.75 IC4.14 | IC9.7 IC9.8 IC8.8 | IC9.10 72.39,19.05 74.93,16.51 IC9.4 | IC10.7 v83.06,24.13
  Bottom 0.305: v69.85,30.58 69.85,27.69 IC8.8 | IC9.4 76.71,16.51 75.69,17.53 75.69,21.72 | 75.69,21.72 75.69,22.99 76.83,24.13 IC9.7 | IC9.6 75.82,21.59 75.69,21.72 | v83.06,24.13 83.06,28.7 C8.2
  pour Bottom: 0,0 0,58.42 107.95,58.42 107.95,0
MIX_CV  (via drill 0.35)
  Top 0.305: v95.25,26.67 57.78,26.67 55.88,24.77 53.98,26.67 v46.99,26.67
  Bottom 0.305: v95.25,26.67 95.25,38.1 IC5.3 | v46.99,26.67 44.96,24.64 44.96,5.08 44.45,4.57 JP2.9
MOD_MIX_OUT  (via drill 0.35)
  Top 0.305: IC5.14 90.17,31.62 R12.1 86.36,27.81 v74.04,27.81
  Bottom 0.305: v74.04,27.81 73.99,27.77 73.99,7.95 69.85,3.81 JP2.19
N$1  (via drill 0.35)
  Top 0.305: v51.69,35.56 IC2.2
  Bottom 0.305: IC7.9 43.18,24.13 51.69,32.64 v51.69,35.56
N$2
  Top 0.305: IC5.1 IC5.2 R4.2
N$3
  Bottom 0.305: D7.C 38.73,15.24 R25.2 38.61,11.94 41.66,8.89 IC7.15
N$4  (via drill 0.35)
  Top 0.305: D7.A 41.78,30.1 58.19,30.1 v58.29,30.2
  Bottom 0.305: IC2.3 58.54,38.1 58.9,37.74 58.9,30.97 58.29,30.36 v58.29,30.2
N$5
  Bottom 0.305: IC7.4 49.91,14.73 46.48,14.73 46.35,14.86 46.35,24.89 52.58,31.11 52.58,40.13 52.07,40.64 IC2.13
N$6  (via drill 0.35)
  Top 0.305: v53.47,36.96 53.47,37.47 52.83,38.1 IC2.14
  Bottom 0.305: IC7.7 50.29,21.59 48.9,22.99 48.9,26.16 53.47,30.73 v53.47,36.96
N$7
  Bottom 0.305: IC7.10 42.29,21.59 40.77,23.11 40.77,24.51 47.4,31.14 47.4,34.7 48.26,35.56 IC2.15
N$8
  Bottom 0.305: IC7.1 52.07,6.35 52.45,6.73 52.45,28.19 54.38,30.12 54.38,40.51 51.71,43.18 IC2.12
N$9  (via drill 0.35)
  Top 0.305: IC7.5 v53.47,16.51
  Bottom 0.305: v53.47,16.51 54.48,17.53 54.48,28.07 57.15,30.73 IC2.1
N$10  (via drill 0.35)
  Top 0.305: IC7.6 v53.59,19.05
  Bottom 0.254: 55.32,41.48 55.47,41.63
  Bottom 0.305: 55.47,41.63 57.02,43.18 IC2.5 | 55.32,41.48 55.32,29.92 53.57,28.17 53.57,19.07 v53.59,19.05
N$11  (via drill 0.35)
  Top 0.305: v51.56,39.37 52.83,40.64 IC2.4
  Bottom 0.305: v51.56,39.37 48.13,39.37 46.48,37.72 46.48,31.75 39.5,24.77 39.5,21.97 42.42,19.05 IC7.11
N$12
  Top 0.305: IC11.3 100.71,11.43 103.89,14.61 R8.1 R10.1
N$13
  Top 0.508: X2.9 X2.10 D1.A
N$14
  Top 0.508: D1.C 11.43,29.34 R1.2
N$15
  Top 0.305: IC4.4 85.09,40.64 86.61,42.16 R3.2 86.61,48.13 88.01,49.53 90.04,49.53 JP1.1
N$16
  Bottom 0.305: IC8.15 55.63,8.89 53.59,10.92 R27.2 56.13,17.78 D8.C
N$17  (via drill 0.35)
  Top 0.305: v67.94,27.43 67.94,27.3 D8.A
  Bottom 0.305: IC3.3 68.35,38.1 67.97,37.72 67.97,27.46 v67.94,27.43
N$18
  Top 0.305: IC11.7 IC11.8
N$19  (via drill 0.35)
  Top 0.305: v65.02,36.96 63.88,38.1 IC3.14
  Bottom 0.305: IC8.4 64.14,13.97 63.5,14.61 63.5,29.34 65.02,30.86 v65.02,36.96
N$20  (via drill 0.35)
  Top 0.305: v65.79,33.78 65.79,33.91 64.14,35.56 IC3.15
  Bottom 0.305: IC8.7 65.41,21.59 64.39,22.61 64.39,28.7 65.79,30.1 v65.79,33.78
N$21
  Bottom 0.305: IC8.10 57.53,21.59 56.9,22.23 56.9,25.78 59.56,28.45 59.56,41.78 60.96,43.18 IC3.12
N$22
  Bottom 0.305: IC8.1 71.12,6.35 73.28,8.51 73.28,31.24 71.5,33.02 IC3.1
N$23  (via drill 0.35)
  Top 0.305: v71.19,28.38 66.47,28.38 v66.47,28.32 | v64.64,20.32 64.77,20.45 68.07,20.45 68.07,22.99 v71.75,22.99
  Bottom 0.305: v64.64,20.32 64.2,19.88 64.2,16.95 64.64,16.51 IC8.5 | v66.47,28.32 66.47,40.55 69.09,43.18 IC3.5 | v71.75,22.99 71.75,28.38 v71.19,28.38 71.13,28.45
N$24  (via drill 0.35)
  Top 0.305: v71.12,31.75 73.03,33.66 71.12,35.56 IC3.2
  Bottom 0.305: IC8.6 67.69,20.45 70.99,20.45 72.62,22.08 72.62,30.25 v71.12,31.75
N$25  (via drill 0.35)
  Top 0.305: v66.04,41.91 67.31,40.64 IC3.4
  Bottom 0.305: v66.04,41.91 60.84,41.91 60.22,41.29 60.22,25.68 IC8.9
N$26
  Top 0.305: IC11.4 100.71,13.97 101.73,14.99 R9.1 R11.1
N$27
  Top 0.508: D2.A 10.54,8.51 R2.2
N$28
  Top 0.508: X2.1 X2.2 D2.C
N$29
  Top 0.305: IC11.10 IC11.9
N$30
  Top 0.305: IC11.1 99.19,5.21 R7.1
N$31
  Bottom 0.305: IC4.13 77.47,35.56 80.01,38.1 80.01,50.67 82.42,53.09 JP1.4
N$32
  Bottom 0.305: IC4.12 78.74,40.64 78.74,52.07 79.88,53.21 JP1.5
N$33  (via drill 0.35)
  Top 0.305: v62.61,12.45 62.61,10.29 64.01,8.89 IC8.2
  Bottom 0.305: v62.61,12.45 62.61,30.23 64.26,31.88 64.26,39.12 62.74,40.64 IC3.13
N$34
  Bottom 0.305: IC8.3 67.06,11.43 68.07,12.45 68.07,15.49 69.09,16.51 IC9.11
N$35  (via drill 0.35)
  Top 0.305: IC9.3 74.93,13.97 73.53,15.37 64.01,15.37 61.59,17.78 49.53,17.78 48.39,16.64 v48.39,13.72
  Bottom 0.305: v48.39,13.72 48.39,12.57 49.53,11.43 IC7.3
N$37
  Top 0.305: TR2.E TR2.S 7.62,46.99 10.16,49.53 R13.2
N$47
  Top 0.305: R22.1 D6.C | 20.7,27.69 27.81,27.67 27.81,35.43 29.46,37.08 Q6.C
  Top 0.508: D6.C 20.7,27.69
N$48
  Top 0.305: R23.1 22.99,22.61 D6.A
N$49
  Top 0.305: IC1.2 D4.A
N$50  (via drill 0.35)
  Top 0.305: D4.C 25.4,33.02 IC1.1 22.48,35.18 C10.1 20.32,31.5 18.41,33.4 13.59,33.4 11.43,35.56 Q3.C | IC6.12 28.32,13.97 30.48,16.13 v30.48,17.27
  Bottom 0.305: D4.C 30.48,30.48 v30.48,17.27
N$51
  Top 0.305: Q3.B 6.35,36.83 Q2.E 10.16,40.64 R14.1
N$52
  Top 0.305: IC6.9 26.67,21.59 25.27,20.19 25.27,16.76 R24.2 R23.2
N$53
  Top 0.305: IC6.13 IC6.14 C11.+
N$55
  Top 0.305: R19.1 29.34,45.21 Q4.E Q5.E
N$68  (via drill 0.35)
  Top 0.305: v84.58,11.56 84.58,11.94 83.19,13.34 v83.19,13.84
  Bottom 0.305: v84.58,11.56 84.58,9.65 85.34,8.89 IC10.1 | v83.19,13.84 83.19,16.76 80.9,19.05 IC10.10
N$69
  Top 0.254: 85.6,19.05 83.19,16.64
  Top 0.305: 83.19,16.64 80.9,16.64 IC10.11 | 85.6,19.05 IC10.5
  Bottom 0.305: IC10.2 86.87,11.43 85.72,12.57 85.72,18.03 86.74,19.05 IC10.5 IC10.6
N$70
  Top 0.305: R17.2 29.34,47.62 D5.C 27.94,46.23 27.94,44.07 Q4.B
N$80
  Bottom 0.305: Q1.1 101.6,34.29 100.84,33.53 100.84,31.37 102.87,29.34 102.87,27.94 106.45,24.36 106.45,7.39 105.41,6.35 R7.2
N$84
  Top 0.305: IC5.6 R4.1 100.33,43.94 101.6,42.67 101.6,39.37 D3.C R5.2
N$85
  Top 0.305: Q4.C 32.64,38.73 Q5.B 37.47,41.27 38.86,39.88 R18.2
N$86
  Top 0.305: R20.2 35.18,38.48 Q5.C 34.42,37.97 R21.1
N$87
  Top 0.305: D3.A 102.87,46.99 | 102.87,46.99 Q1.2 | IC5.7 100.33,48.26 101.6,46.99 102.87,46.99
N$88
  Top 0.305: R6.2 Q1.3 105.41,49.53 R5.1
N$89
  Bottom 0.305: Q6.B 32.77,34.54 34.42,32.89 R21.2
N$91
  Top 0.305: R12.2 IC5.13 92.71,35.56 99.06,29.21 TR1.1 | IC11.5 98.04,16.51 97.03,17.53 97.03,26.92 99.31,29.21 TR1.1 | TR1.1 TR1.2
NOT_A  (via drill 0.35)
  Top 0.305: v72.17,20.41 72.17,21.55 72.14,21.59 | 72.14,21.59 IC9.9 | 71.12,13.97 IC9.12 72.01,13.97 v72.2,14.16 | IC10.8 79.5,22.86 73.79,22.86 72.52,21.59 72.14,21.59
  Bottom 0.305: v72.17,20.41 72.2,20.38 v72.2,14.16
NOT_B  (via drill 0.35)
  Top 0.305: IC9.2 v74.93,11.43 | v74.93,19.05 IC9.5 77.72,19.05 80.26,21.59 IC10.9
  Bottom 0.305: v74.93,11.43 v74.93,19.05
OR_MOD
  Top 0.254: IC10.4 88.39,16 89.03,15.37 94.36,15.37 96.27,13.46 96.27,10.92 97.03,10.16 97.92,10.16
  Top 0.305: R8.2 103.89,7.87 101.6,10.16 97.92,10.16 97.66,10.16
VCO_IN
  Top 0.305: Q2.B R13.1 11.43,43.18 12.7,44.45 12.7,54.61 20.32,54.61 22.23,52.7 26.67,52.7 JP3.2
VCO_OUT  (via drill 0.35)
  Top 0.305: R15.1 C11.- 21.59,7.62 22.86,6.35 v26.67,6.35
  Bottom 0.305: v26.67,6.35 JP2.2
X
  Top 0.254: 36.32,19.05 38.86,16.51 40.64,16.51 40.77,16.38
  Top 0.305: R24.1 25.27,24.13 IC6.8 29.21,24.13 34.29,19.05 IC6.5 36.32,19.05 | IC7.14 47.24,11.43 48.51,10.16 55.75,10.16 57.02,11.43 IC8.14 | 40.77,16.38 R26.2
  Bottom 0.305: R28.2 55.63,12.45 56.64,11.43 IC8.14 | IC7.14 42.42,11.43 40.77,13.08 R26.2
X_OUT
  Top 0.305: IC6.7 IC6.6
  Bottom 0.305: IC6.6 36.83,21.59 37.34,21.08 37.34,5.59 36.83,5.08 JP2.6
XOR_MOD  (via drill 0.35)
  Top 0.254: IC10.3 89.15,13.21 89.15,12.83 94.11,12.83 95.25,11.68 95.25,8.89 96.65,7.49
  Top 0.305: R9.2 96.65,7.49 | v105.41,11.18 TR1.3
  Bottom 0.305: v105.41,11.18 103.63,11.18 101.73,9.27 R9.2

### Text on the board
tPlace: Design Published under / Creative Commons / CC BY-SA License
tNames: CC | JLCJLCJLCJLC | m0xpd | ver 2.0 | Apr 2023 | SubHarmonics